# Altium schematic sheet IPG-V1_rev0.24.SchDoc (part 3 of 3)
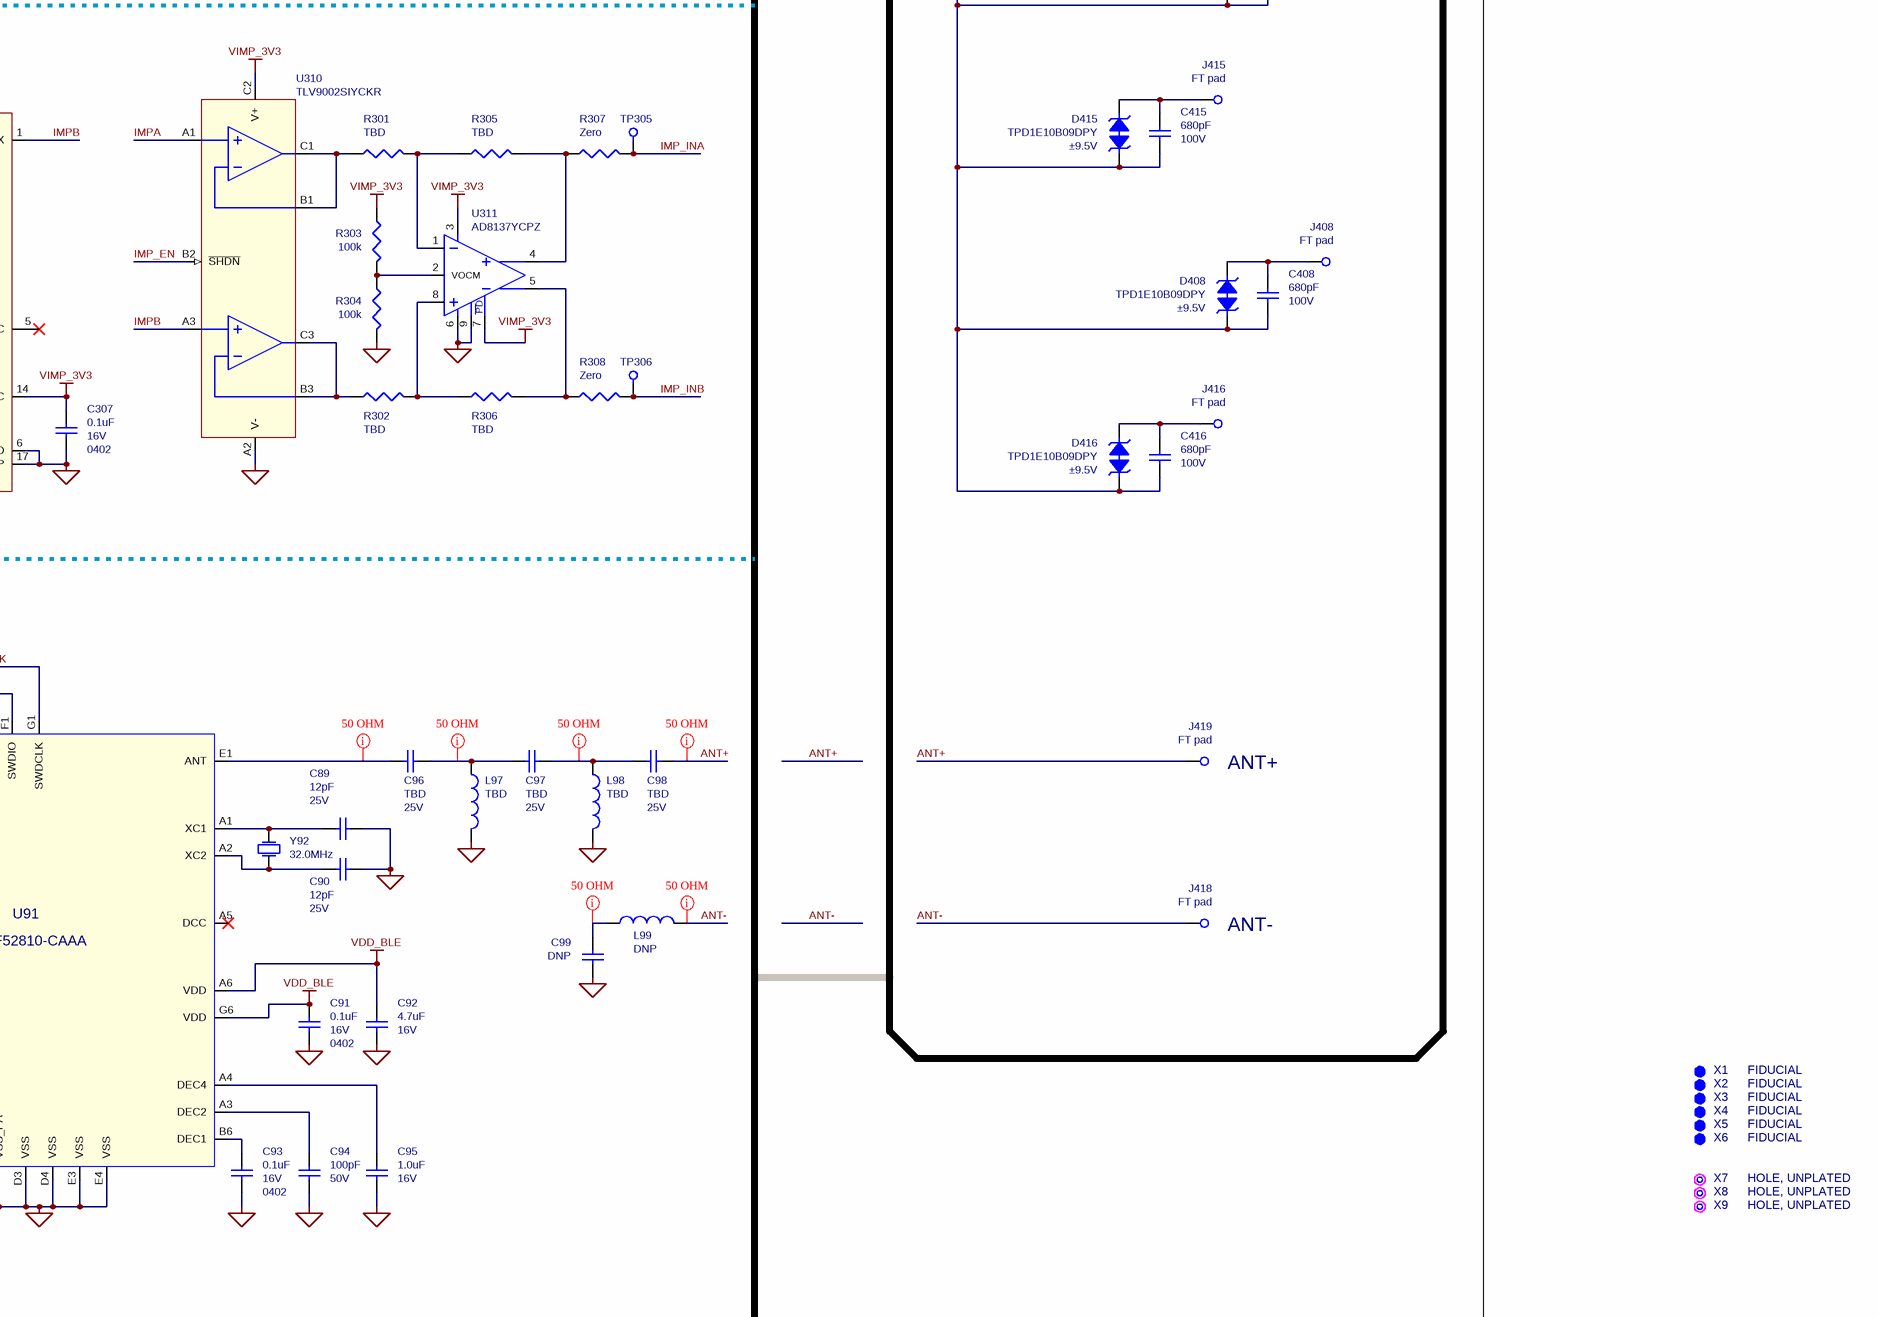
[diagram p10: IPG-V1_rev0.24.SchDoc, bottom right]

## Library data of the parts
C1 C2 = Cap: Resistor, Zero ohms, 40V, 40mW, 1%, 0402, Implant-grade; Manufacturer: Panasonic; Manufacturer PN: ERJ-2GE0R00X; Medical Grade MFR: Mini-Systems; Medical Grade MFR PN: WAJ20PG-NS62TRX; Rating: TBD; Length (mm): 1.10 ±0.10; PCB Footprint: cap0402_reduced; Thickness (mm): 0.56; Width (mm): 0.50 ±0.10; Category: Capacitor; Package Description: 0402
C3 C15 C16 C26 C37 C45 C46 C92 C511 C514 = Cap: Capacitor, 4.7uF, X5R, 16V, 10%, 0603, Implant-grade; Manufacturer: Murata; Manufacturer PN: GRM188R61C475KE11; Length (mm): 1.60 ±0.10; Medical Grade MFR: Murata; Medical Grade MFR PN: GCH188R61C475KE11; PCB Footprint: cap0603_reduced; Thickness (mm): 0.80 ±0.10; Width (mm): 0.80 ±0.10; Category: Capacitor; Package Description: 0603
C4 C5 C7 C9 C11-C14 C17 C27-C33 C35 C36 C38 C39 C91 C93 C206 C207 C243 C246 C247 C301 C303-C307 = Cap: Capacitor, 0.1uF, X7R, 16V, 10%, 0402, Implant-grade; Manufacturer: Murata; Manufacturer PN: GCM155R71C104KA55; Length (mm): 1.00 ±0.05; Medical Grade MFR: Murata; Medical Grade MFR PN: GCH155R71C104KE01; PCB Footprint: cap0402_reduced; Thickness (mm): 0.50 ±0.05; Width (mm): 0.50 ±0.05; Category: Capacitor
C6 C8 C507 = Cap: Capacitor, 470pF, X7R, 50V, 10%, 0402, Implant-grade; Manufacturer: Murata; Manufacturer PN: GCM155R71H471KA37D; Length (mm): 1.00 ±0.05; Medical Grade MFR: Murata; Medical Grade MFR PN: GCH155R71H471KE01; PCB Footprint: cap0402_reduced; Thickness (mm): 0.50 ±0.05; Width (mm): 0.50 ±0.05; Category: Capacitor; Package Description: 0402
C10 C18 C19 C34 C95 C244 = Cap: Capacitor, 1.0uF, X5R, 16V, 10%, 0603, Implant-grade; Manufacturer: Murata; Manufacturer PN: GCM188R71C105KA64; Length (mm): 1.60 ±0.10; Medical Grade MFR: Murata; Medical Grade MFR PN: GCH188R71C105KE01; PCB Footprint: cap0603_reduced; Thickness (mm): 0.80 ±0.10; Width (mm): 0.80 ±0.10; Category: Capacitor; Package Description: 0603
C20 C21 C505 C506 C510 = Cap: Capacitor, 4.7uF, X7S, 35V, 10%, 0805, Implant-grade; Manufacturer: Murata; Manufacturer PN: GCM21BC7YA475KE36L; Length (mm): 2.00 ±0.20; Medical Grade MFR: Murata; Medical Grade MFR PN: GCH21BC7YA475KE11; PCB Footprint: cap0805_reduced; Thickness (mm): 1.25 ±0.20; Width (mm): 1.25 ±0.20; Category: Capacitor; Package Description: 0805
C22-C25 C87-C90 = Cap: Capacitor, 12pF, C0G, 25V, ±0.05pF, 0402, Implant-grade; Manufacturer: AVX; Medical Grade MFR PN: MP023K1R5ABWG; Length (mm): 1.00 ±0.10; Manufacturer PN: C0402C120J3GACAUTO; Medical Grade MFR: AVX; PCB Footprint: cap0402_reduced; Thickness (mm): 0.40 ±0.10; Width (mm): 0.55 ±0.07; Category: Capacitor
  C87-C90: Package Description: 0402
C94 C508 = Cap: Capacitor, 100pF, C0G, 50V, 5%, 0402, Implant-grade; Manufacturer: Murata; Manufacturer PN: GCM1555C1H101JA16D; Length (mm): 1.00 ±0.05; Medical Grade MFR: Murata; Medical Grade MFR PN: GCH1555C1H101JE01; PCB Footprint: cap0402_reduced; Thickness (mm): 0.50 ±0.05; Width (mm): 0.50 ±0.05; Category: Capacitor; Package Description: 0402
C96-C98 C501-C504 = Cap: Manufacturer: TBD; Manufacturer PN: TBD; Medical Grade MFR: TBD; Medical Grade MFR PN: TBD; Category: Capacitor
  C96-C98: Length (mm): 1.00 ±0.10; PCB Footprint: cap0402_reduced; Thickness (mm): 0.40 ±0.10; Width (mm): 0.55 ±0.07; Package Description: 0402
  C501-C504: Length (mm): 2.00 ±0.20; PCB Footprint: cap0805_reduced; Rating: TBD; Thickness (mm): 1.37; Width (mm): 1.25 ±0.20; Package Description: 0805
C99 = Cap: Rating: 25V; Length (mm): 1.00 ±0.10; Manufacturer: N/A; Manufacturer PN: N/A; Medical Grade MFR: N/A; Medical Grade MFR PN: N/A; PCB Footprint: cap0402_reduced; Thickness (mm): 0.40 ±0.10; Width (mm): 0.55 ±0.07; Category: Capacitor; Package Description: 0402
C201 C241 C509 = Cap: Capacitor, 1000pF, X7R, 50V, 10%, 0402, Implant-grade; Manufacturer: Murata; Medical Grade MFR PN: GCH155R71H102KE01; Length (mm): 1.00 ±0.05; Manufacturer PN: GRM1555C1H102JA01D; Medical Grade MFR: Murata; PCB Footprint: cap0402_reduced; Thickness (mm): 0.50 ±0.05; Width (mm): 0.50 ±0.05; Category: Capacitor; Package Description: 0402
C202 C205 = Cap: Capacitor, 0.33uF, X7S, 16V, 10%, 0402; Manufacturer: TDK; Medical Grade MFR: TBD; Length (mm): 1.00 ±0.05; Manufacturer PN: CGA2B1X7S1C334K050BC; Medical Grade MFR PN: TBD; PCB Footprint: cap0402_reduced; Thickness (mm): 0.50 ±0.05; Width (mm): 0.50 ±0.05; Category: Capacitor; Package Description: 0402
C203 = Cap: Capacitor, 1500pF, X7R, 50V, 10%, 0402; Manufacturer: Murata; Medical Grade MFR: TBD; Length (mm): 1.00 ±0.05; Manufacturer PN: GCM155R71H152KA37D; Medical Grade MFR PN: TBD; PCB Footprint: cap0402_reduced; Thickness (mm): 0.50 ±0.05; Width (mm): 0.50 ±0.05; Category: Capacitor; Package Description: 0402
C204 = Cap: Capacitor, 0.01uF, X7R, 50V, 10%, 0402, Implant-grade; Manufacturer: Murata; Manufacturer PN: GCM155R71H103KA55J; Length (mm): 1.00 ±0.05; Medical Grade MFR: Murata; Medical Grade MFR PN: GCH155R71H103KE01; PCB Footprint: cap0402_reduced; Thickness (mm): 0.50 ±0.05; Width (mm): 0.50 ±0.05; Category: Capacitor; Package Description: 0402
C242 C245 = Cap: Capacitor, 2.2uF, X7R, 16V, 10%, 0603, Implant-grade; Manufacturer: Murata; Medical Grade MFR: TBD; Length (mm): 1.60 ±0.10; Manufacturer PN: GRM188Z71C225ME43J; Medical Grade MFR PN: TBD; PCB Footprint: cap0603_reduced; Thickness (mm): 0.80 ±0.10; Width (mm): 0.80 ±0.10; Category: Capacitor; Package Description: 0603
C381-C384 C397 = Cap: Capacitor, 10uF, X5R, 50V, 10%, 0805; Manufacturer: Murata; Length (mm): 2.00 ±0.20; Manufacturer PN: GRM21BR61H106ME43L; Medical Grade MFR: N/A; Medical Grade MFR PN: N/A; PCB Footprint: cap0805_reduced; Thickness (mm): 1.25 ±0.20; Width (mm): 1.25 ±0.20; Category: Capacitor; Package Description: 0805
C401-C416 = Cap: Capacitor, 680pF, C0G, 100V, 5%, 0402; Manufacturer: TDK; Medical Grade MFR: TBD; Length (mm): 1.00 ±0.10; Manufacturer PN: C1005C0G2A681J050BE; Medical Grade MFR PN: TBD; PCB Footprint: TBD; Thickness (mm): 0.50 ±0.10; Width (mm): 0.50 ±0.10; Category: Capacitor; Package Description: 0402
C512 C513 = Cap: Capacitor, 0.022uF, X7R, 50V, 10%, 0402, Implant-grade; Manufacturer: Murata; Manufacturer PN: GCM155R71H223KA55; Length (mm): 1.00 ±0.05; Medical Grade MFR: Murata; Medical Grade MFR PN: GCH155R71H223KE01; PCB Footprint: cap0402_reduced; Thickness (mm): 0.50 ±0.05; Width (mm): 0.50 ±0.05; Category: Capacitor; Package Description: 0402
D1-D5 D8-D10 D502 D503 D508 = NSR0130P2T5G: Schottky, 30V, 100mA, 385mV, 200mW, SOD-923; Manufacturer: ON Semiconductor; Medical Grade MFR: TBD; Length (mm): 1.00 ±0.05; Manufacturer PN: NSR0130P2T5G; Medical Grade MFR PN: TBD; PCB Footprint: TBD; Rating: 30V; Thickness (mm): 0.40 ±0.03; Value: NSR0130P2T5G; Width (mm): 0.60 ±0.05; Category: Diode
D6 D7 D11-D14 D501 D504-D507 = NSR05T40XV2T5G: Schottky, 40V, 500mA, 530mV, SOD-523; Manufacturer: ON Semiconductor; Medical Grade MFR: TBD; Length (mm): 1.60 ±0.10; Manufacturer PN: NSR05T40XV2T5G; Medical Grade MFR PN: TBD; PCB Footprint: TBD; Rating: 40V, 500mA; Thickness (mm): 0.60 ±0.10; Value: NSR05T40XV2T5G; Width (mm): 0.80 ±0.10; Category: Diode
D401-D418 = TPD1E10B09: TVS Diode, Bidirectional, ±9.5V, 4.5A, 0402; Manufacturer: Texas Instruments; Medical Grade MFR: TBD; Category: TVS Diode; Length (mm): 1.00 ±0.10; Manufacturer PN: TPD1E10B09DPY; Medical Grade MFR PN: TBD; PCB Footprint: TBD; Thickness (mm): 0.38 ±0.07; Width (mm): 0.60 ±0.10; Package Description: TBD
F1 F2 = Fuse 2: Fuse, 750mA, 63V, 1206; Manufacturer: Littelfuse; Medical Grade MFR PN: 0440.750WRA; PCB Footprint: fuse1206_reduced; Length (mm): 3.20 ±0.18; Manufacturer PN: 0440.750WR; Medical Grade MFR: Littelfuse; Rating: 750mA; Thickness (mm): 0.84 ±0.01; Width (mm): 1.63 ±0.10; Category: Fuse
J1-J4 = Kovar Block: Kovar block, TBD; Manufacturer: TBD; Manufacturer PN: TBD; Medical Grade MFR: N/A; Medical Grade MFR PN: N/A; PCB Footprint: TBD; Rating: N/A; Value: Kovar block; Category: Kovar block; Length (mm): TBD; Thickness (mm): TBD; Width (mm): TBD
J5 J6 J501 J502 = FT Pad: Coil TH pad, hole size and ring TBD; Value: Coil Solder Pad; Category: Coil Solder Pad; Length (mm): TBD; Manufacturer: N/A; Manufacturer PN: N/A; Medical Grade MFR: N/A; Medical Grade MFR PN: N/A; PCB Footprint: TBD; Rating: N/A; Thickness (mm): N/A; Width (mm): TBD; Package Description: N/A
J401-J419 = HOLE_20m: FT pad, Thru-hole, 20 mil hole; PCB Footprint: TBD; Category: FT pad; Length (mm): TBD; Manufacturer: N/A; Manufacturer PN: N/A; Medical Grade MFR: N/A; Medical Grade MFR PN: N/A; Rating: N/A; Thickness (mm): N/A; Width (mm): TBD; Package Description: FT pad
J901 J902 J905 = TMS-104-01-G-S: Header, 1.27mm, male, 1x4, thru-hole; Manufacturer: Samtec; Category: Header; Manufacturer PN: TMS-104-01-G-S
J906-J909 = TMS-106-01-G-S: Header, 1.27mm, male, 1x6, thru-hole; Manufacturer: Samtec; Alt Manufacturer: -; Alt Manufacturer PN: -; Category: Header; Manufacturer PN: TMS-106-01-G-S; Supplier 1: Digi-Key; Supplier Part Number 1: SAM10248-ND
J910 J911 = FTSH-105-01-F-D-K: Connector, 1.27 mm, 2x5, Male, TH; Manufacturer: Samtec; Manufacturer PN: FTSH-105-01-F-D-K; Supplier 1: Mouser; Supplier Part Number 1: 200-FTSH10501FDK
L1 L2 = Inductor: PCB Footprint: sml_0402_reduced; Rating: 500mA; Length (mm): 1.00; Manufacturer: N/A; Manufacturer PN: N/A; Medical Grade MFR: N/A; Medical Grade MFR PN: N/A; Thickness (mm): TBD; Width (mm): 0.50; Category: Inductor
L3 L501 = Inductor: Inductor, 10uH, 600mA, 20%, 1008; Manufacturer: Wurth; Medical Grade MFR: TBD; Length (mm): 2.50 ±0.20; Manufacturer PN: 74438323100; Medical Grade MFR PN: TBD; PCB Footprint: TBD; Rating: 600mA; Thickness (mm): 1.00; Width (mm): 2.00 ±0.20; Category: Inductor
L5 = VLS252010HBX-2R2M-1: Inductor, 2.2uH, 1.76A, 1008; Manufacturer: TDK; Category: Inductor; Rating: 1.76A; Manufacturer PN: VLS252010HBX-2R2M-1
L6 = LQG15HS33NJ02D: Inductor, Unshielded, 33nH, 350mA, 0402; Manufacturer: Murata; Medical Grade MFR: TBD; Category: Inductor; Length (mm): TBD; Manufacturer PN: LQG15HS33NJ02D; Medical Grade MFR PN: TBD; Thickness (mm): TBD; Width (mm): TBD; PCB Footprint: TBD
L97 L98 = Inductor: PCB Footprint: ind0402_reduced; Rating: 1200mA; Category: Inductor; Length (mm): 1.11; Manufacturer: TBD; Manufacturer PN: TBD; Medical Grade MFR: TBD; Medical Grade MFR PN: TBD; Thickness (mm): 0.65; Width (mm): 0.66; Package Description: 0402
L99 = Inductor: PCB Footprint: ind0402_reduced; Category: Inductor; Length (mm): 1.11; Manufacturer: N/A; Manufacturer PN: N/A; Medical Grade MFR: N/A; Medical Grade MFR PN: N/A; Rating: N/A; Thickness (mm): 0.65; Width (mm): 0.66; Package Description: 0402
M1 M2 M5 M13 M21 M22 M24 M27 M28 M30 = DMP21D5UFB4-7B: MOSFET, P-chan, -20V, X2-DFN1006-3; Manufacturer: Diodes Inc; Medical Grade MFR: TBD; Category: Transistor; Length (mm): 1.00 ±0.05; Medical Grade MFR PN: TBD; Rating: -20V; Thickness (mm): 0.40; Width (mm): 0.60 ±0.05; Manufacturer PN: DMP21D5UFB4-7B
M3 M4 M6-M8 M11 M12 M14-M16 M19 M20 M23 M25 M26 M29 M31 M319 = DMN2990UFZ: MOSFET, N-Chan, 20V, DFN0606; Manufacturer: Diodes Inc; Medical Grade MFR: TBD; Category: Transistor; Length (mm): 0.62 ±0.05; Manufacturer PN: DMN2990UFZ; Medical Grade MFR PN: TBD; PCB Footprint: TBD; Rating: 20V; Thickness (mm): 0.38 ±0.02; Value: DMN2990UFZ; Width (mm): 0.62 ±0.05
M9 M10 M17 M18 M506 = DMP22D4UFO: MOSFET, P-chan, -20V, DFN1010-3; Manufacturer: Diodes Inc; Medical Grade MFR: TBD; Category: Transistor; Length (mm): 0.96 ±0.04; Manufacturer PN: DMP2043UCA3-7; Medical Grade MFR PN: TBD; PCB Footprint: TBD; Rating: -20V; Thickness (mm): 0.32 ±0.03; Width (mm): 0.96 ±0.04
M32 M504 M507 M508 M510 = DMP58D0LFB: MOSFET, P-chan, -50V, DFN1006; Manufacturer: Diodes Inc; Medical Grade MFR: TBD; Category: Transistor; Length (mm): 1.00 ±0.08; Manufacturer PN: DMP58D0LFB; Medical Grade MFR PN: TBD; PCB Footprint: TBD; Rating: -50V; Thickness (mm): 0.50 ±0.03; Width (mm): 0.60 ±0.08; Value: DMP58D0LFB
M33 M91 M318 = DMP22D4UFO: MOSFET, P-chan, -20V, DFN0604; Manufacturer: Diodes Inc; Medical Grade MFR: TBD; Category: Transistor; Length (mm): 0.60 ±0.05; Manufacturer PN: DMP22D4UFO; Medical Grade MFR PN: TBD; PCB Footprint: TBD; Rating: -20V; Thickness (mm): 0.36 ±0.04; Value: DMP22D4UFO; Width (mm): 0.40 ±0.05
  M91: PackageDescription: TBD
  M318: Package Description: TBD
M34 M501-M503 M505 = DMN62D1SFB: MOSFET, N-Chan, 60V, 320mA, DFN1006; Manufacturer: Diodes Inc; Medical Grade MFR: TBD; Category: Transistor; Length (mm): 1.00 ±0.08; Manufacturer PN: DMN62D1LFB-7B; Medical Grade MFR PN: TBD; PCB Footprint: TBD; Rating: 60V; Thickness (mm): 0.50 ±0.03; Width (mm): 0.60 ±0.08
M301-M304 M317 = DMN65D8LFB-7B: MOSFET, N-Chan, 60V, DFN1006; Manufacturer: Diodes Inc; Medical Grade MFR: TBD; Category: Transistor; Length (mm): 1.00 ±0.08; Manufacturer PN: DMN65D8LFB-7B; Medical Grade MFR PN: TBD; PCB Footprint: TBD; Thickness (mm): 0.50 ±0.03; Width (mm): 0.60 ±0.08
M509 M511-M514 = DMN62D1SFB: MOSFET, N-Chan, 60V, DFN1006; Manufacturer: Diodes Inc; Medical Grade MFR: TBD; Category: Transistor; Length (mm): 1.00 ±0.08; Manufacturer PN: DMN62D1SFB; Medical Grade MFR PN: TBD; PCB Footprint: TBD; Rating: 60V; Thickness (mm): 0.50 ±0.03; Width (mm): 0.60 ±0.08; Value: DMN62D1SFB
M515 = DMN62D1SFB: MOSFET, N-Chan, 20V, DFN1006; Manufacturer: Diodes Inc; Medical Grade MFR: TBD; Category: Transistor; Length (mm): 1.00 ±0.08; Manufacturer PN: DMN2501UFB4; Medical Grade MFR PN: TBD; PCB Footprint: TBD; Rating: 20V; Thickness (mm): 0.50 ±0.03; Width (mm): 0.60 ±0.08; Value: DMN2501UFB4
Q301-Q304 Q317 = DP0150BDJ: Transistor, Dual PNP, -40V, 200mA, SOT963; Manufacturer: ON Semi; Medical Grade MFR: TBD; Category: Transistor; Length (mm): 1.00 ±0.05; Manufacturer PN: NST3906DP6T5G; Medical Grade MFR PN: TBD; PCB Footprint: TBD; Thickness (mm): 0.45 ±0.05; Value: NST3906DP6T5G; Width (mm): 1.00 ±0.05; Package Description: SOT963
Q318 Q321-Q324 Q337 = BC847BLP-7B: Transistor, NPN, 45V, 100mA, DFN1006; Manufacturer: Diodes Inc; Medical Grade MFR: TBD; Category: Transistor; Length (mm): 1.00 ±0.08; Manufacturer PN: BC847BLP-7B; Medical Grade MFR PN: TBD; PCB Footprint: TBD; Thickness (mm): 0.50 ±0.03; Width (mm): 0.60 ±0.08
R1 R2 R4 R6 R7 R13 R15 R21 R36 R37 R40-R43 R201 R202 R207 R208 R213 R214 R241 R242 R247 R248 R253 R254 R309 R351-R354 R367 = RC1005F106CS: Resistor, 10.0M, 40V, 40mW, 1%, 0402, Implant-grade; Manufacturer: Panasonic; Manufacturer PN: ERJ-2GEJ106X; Medical Grade MFR: Mini-Systems; Length (mm): 1.12 ±0.10; Medical Grade MFR PN: WA20SM-1005F-NS62TRX; PCB Footprint: res0402_reduced; Rating: 40V; Thickness (mm): 0.33 ±0.08; Width (mm): 0.56 ±0.08; Category: Resistor
  R202 R242 R247 R248 R253 R254: Package Description: 0402
R3 R33 = RC1005F106CS: Resistor, 5.10M, 40V, 40mW, 5%, 0402, Implant-grade; Manufacturer: Panasonic; Manufacturer PN: ERJ-2GEJ515X; Medical Grade MFR: Mini-Systems; Length (mm): 1.12 ±0.10; Medical Grade MFR PN: WA20SM-5104F-NS62TRX; PCB Footprint: res0402_reduced; Rating: 40V; Thickness (mm): 0.33 ±0.08; Width (mm): 0.56 ±0.08; Category: Resistor
R5 R34 R51-R55 R298 = RC1005F106CS: Resistor, 10.0k, 40V, 40mW, 1%, 0402, Implant-grade; Manufacturer: Panasonic; Manufacturer PN: ERJ-2RKF1002X; Medical Grade MFR: Mini-Systems; Length (mm): 1.12 ±0.10; Medical Grade MFR PN: WA20SM-1002F-NS62TRX; PCB Footprint: res0402_reduced; Rating: 40V; Thickness (mm): 0.33 ±0.08; Width (mm): 0.56 ±0.08; Category: Resistor
R8 R16 = RC1005F106CS: Resistor, 4.02k, 40V, 40mW, 1%, 0402, Implant-grade; Manufacturer: Panasonic; Manufacturer PN: ERJ-2RKF4021X; Medical Grade MFR: Mini-Systems; Length (mm): 1.12 ±0.10; Medical Grade MFR PN: WA20SM-4021F-NS62TRX; PCB Footprint: res0402_reduced; Rating: 40V; Thickness (mm): 0.33 ±0.08; Width (mm): 0.56 ±0.08; Category: Resistor
R9 R17 = RC1005F106CS: Resistor, 7.50k, 40V, 40mW, 1%, 0402, Implant-grade; Manufacturer: Panasonic; Manufacturer PN: ERJ-2RKF7501X; Medical Grade MFR: Mini-Systems; Length (mm): 1.12 ±0.10; Medical Grade MFR PN: WA20SM-7501F-NS62TRX; PCB Footprint: res0402_reduced; Rating: 40V; Thickness (mm): 0.33 ±0.08; Width (mm): 0.56 ±0.08; Category: Resistor
R10 R18 = RC1005F106CS: Resistor, 619k, 40V, 100mW, 0.1%, 0402; Manufacturer: Vishay; Medical Grade MFR: TBD; Length (mm): 1.12 ±0.10; Manufacturer PN: MCS0402MD6193BE000; Medical Grade MFR PN: TBD; PCB Footprint: res0402_reduced; Thickness (mm): 0.33 ±0.08; Width (mm): 0.56 ±0.08; Category: Resistor
R11 R19 = RC1005F106CS: Resistor, 243k, 40V, 100mW, 0.1%, 0402; Manufacturer: TE Connectivity; Medical Grade MFR: TBD; Length (mm): 1.12 ±0.10; Manufacturer PN: RP73PF1E243KBTDF; Medical Grade MFR PN: TBD; PCB Footprint: res0402_reduced; Thickness (mm): 0.33 ±0.08; Width (mm): 0.56 ±0.08; Category: Resistor
R12 R14 R20 R22-R24 R26 R27 R29 R32 R209 R210 R212 R249 R250 R252 R276 R279 R502-R504 R506 R507 R509 R510 R512-R515 R517-R519 R521 R525 R526 = RC1005F106CS: Resistor, 1.00M, 40V, 40mW, 1%, 0402, Implant-grade; Manufacturer: Panasonic; Manufacturer PN: ERJ-2RKF1004X; Medical Grade MFR: Mini-Systems; Length (mm): 1.12 ±0.10; Medical Grade MFR PN: WA20SM-1004F-NS62TRX; PCB Footprint: res0402_reduced; Rating: 40V; Thickness (mm): 0.33 ±0.08; Width (mm): 0.56 ±0.08; Category: Resistor
  R210 R212 R250: Package Description: 0402
R25 R28 R371-R374 R387 R523 = RC1005F106CS: Resistor, 2.00M, 40V, 40mW, 1%, 0402, Implant-grade; Manufacturer: Panasonic; Manufacturer PN: ERJ-2GEJ205X; Medical Grade MFR: Mini-Systems; Length (mm): 1.12 ±0.10; Medical Grade MFR PN: WA20SM-2004F-NS62TRX; PCB Footprint: res0402_reduced; Rating: 40V; Thickness (mm): 0.33 ±0.08; Width (mm): 0.56 ±0.08; Category: Resistor
R30 R47 R48 R215 R255 R300 R307 R308 R531 = R_ZERO_0402: Resistor, Zero ohms, 40V, 40mW, 1%, 0402, Implant-grade; Manufacturer: Panasonic; Manufacturer PN: ERJ-2GE0R00X; Medical Grade MFR: Mini-Systems; Length (mm): 1.12 ±0.10; Medical Grade MFR PN: WAJ20PG-NS62TRX; PCB Footprint: res0402_reduced; Rating: 40V; Thickness (mm): 0.33 ±0.08; Width (mm): 0.56 ±0.08; Category: Resistor
  R215 R255 R300: Package Description: 0402
  R307 R308: Package Description: TBD
R31 R49 R50 R281-R284 R297 R299 R524 R527 R529 R530 = RC1005F106CS: Length (mm): 1.12 ±0.10; Manufacturer: N/A; Manufacturer PN: N/A; Medical Grade MFR: N/A; Medical Grade MFR PN: N/A; PCB Footprint: res0402_reduced; Rating: N/A; Thickness (mm): 0.33 ±0.08; Width (mm): 0.56 ±0.08; Category: Resistor
R35 = RC1005F106CS: Resistor, 100, 40V, 40mW, 1%, 0402, Implant-grade; Manufacturer: Panasonic; Manufacturer PN: ERJ-2RKF1000X; Medical Grade MFR: Mini-Systems; Length (mm): 1.12 ±0.10; Medical Grade MFR PN: WA20SM-1000F-NS62TRX; PCB Footprint: res0402_reduced; Rating: 40V; Thickness (mm): 0.33 ±0.08; Width (mm): 0.56 ±0.08; Category: Resistor
R38 = RC1005F106CS: Resistor, 340k, 40V, 40mW, 1%, 0402, Implant-grade; Manufacturer: Panasonic; Manufacturer PN: ERJ-2RKF3403X; Medical Grade MFR: Mini-Systems; Length (mm): 1.12 ±0.10; Medical Grade MFR PN: WA20SM-3403F-NS62TRX; PCB Footprint: res0402_reduced; Rating: 40V; Thickness (mm): 0.33 ±0.08; Width (mm): 0.56 ±0.08; Category: Resistor
R39 R520 = RC1005F106CS: Resistor, 40.2k, 40V, 40mW, 1%, 0402, Implant-grade; Manufacturer: Panasonic; Manufacturer PN: ERJ-2RKF4022X; Medical Grade MFR: Mini-Systems; Length (mm): 1.12 ±0.10; Medical Grade MFR PN: WA20SM-4022F-NS62TRX; PCB Footprint: res0402_reduced; Rating: 40V; Thickness (mm): 0.33 ±0.08; Width (mm): 0.56 ±0.08; Category: Resistor
R44 R516 = RC1005F106CS: Resistor, 150k, 40V, 40mW, 1%, 0402, Implant-grade; Manufacturer: Panasonic; Manufacturer PN: ERJ-2RKF1503X; Medical Grade MFR: Mini-Systems; Length (mm): 1.12 ±0.10; Medical Grade MFR PN: WA20SM-1503F-NS62TRX; PCB Footprint: res0402_reduced; Rating: 40V; Thickness (mm): 0.33 ±0.08; Width (mm): 0.56 ±0.08; Category: Resistor
R45 R46 = RC1005F106CS: Resistor, 49.9k, 40V, 40mW, 1%, 0402, Implant-grade; Manufacturer: Panasonic; Manufacturer PN: ERJ-2RKF4992X; Medical Grade MFR: Mini-Systems; Length (mm): 1.12 ±0.10; Medical Grade MFR PN: WA20SM-4992F-NS62TRX; PCB Footprint: res0402_reduced; Rating: 40V; Thickness (mm): 0.33 ±0.08; Width (mm): 0.56 ±0.08; Category: Resistor
R203 R204 R243 R244 = RC1005F106CS: Resistor, 180k, 40V, 40mW, 1%, 0402; Manufacturer: KOA Speer; Medical Grade MFR: Mini-Systems; Medical Grade MFR PN: WA20SM-1803F-NS62TRX; Length (mm): 1.12 ±0.10; Manufacturer PN: RK73H1ETTP1803F; PCB Footprint: res0402_reduced; Rating: 40V; Thickness (mm): 0.33 ±0.08; Width (mm): 0.56 ±0.08; Category: Resistor; Package Description: 0402
R205 R245 = RC1005F106CS: Resistor, 360k, 40V, 40mW, 1%, 0402, Implant-grade; Manufacturer: Panasonic; Manufacturer PN: ERJ-2RKF3603X; Medical Grade MFR: Mini-Systems; Length (mm): 1.12 ±0.10; Medical Grade MFR PN: WA20SM-3603F-NS62TRX; PCB Footprint: res0402_reduced; Rating: 40V; Thickness (mm): 0.33 ±0.08; Width (mm): 0.56 ±0.08; Category: Resistor; Package Description: 0402
R206 R246 = RC1005F106CS: Resistor, 1.40M, 40V, 40mW, 1%, 0402, Implant-grade; Manufacturer: Yageo; Manufacturer PN: RC0402FR-071M4L; Medical Grade MFR: Mini-Systems; Length (mm): 1.12 ±0.10; Medical Grade MFR PN: WA20SM-1404F-NS62TRX; PCB Footprint: res0402_reduced; Rating: 40V; Thickness (mm): 0.33 ±0.08; Width (mm): 0.56 ±0.08; Category: Resistor
R211 = RC1005F106CS: Resistor, 249k, 40V, 40mW, 1%, 0402, Implant-grade; Manufacturer: Panasonic; Manufacturer PN: ERJ-2RKF2493X; Medical Grade MFR: Mini-Systems; Length (mm): 1.12 ±0.10; Medical Grade MFR PN: WA20SM-2493F-NS62TRX; PCB Footprint: res0402_reduced; Rating: 40V; Thickness (mm): 0.33 ±0.08; Width (mm): 0.56 ±0.08; Category: Resistor; Package Description: 0402
R251 R303 R304 R508 R522 = RC1005F106CS: Resistor, 100k, 40V, 40mW, 1%, 0402, Implant-grade; Manufacturer: Panasonic; Manufacturer PN: ERJ-2RKF1003X; Medical Grade MFR: Mini-Systems; Length (mm): 1.12 ±0.10; Medical Grade MFR PN: WA20SM-1003F-NS62TRX; PCB Footprint: res0402_reduced; Rating: 40V; Thickness (mm): 0.33 ±0.08; Width (mm): 0.56 ±0.08; Category: Resistor
  R303 R304: Package Description: TBD
R277 = ERJ-2GEJ106X: Resistor, 100 ohms, 1%, 50V, 0.1W, 0402; Manufacturer: Panasonic; Rating: 50V,100mW; Length (mm): 1.12 ±0.10; Manufacturer PN: ERJ-2RKF1000X; Medical Grade MFR: N/A; Medical Grade MFR PN: N/A; PCB Footprint: res0402_reduced; Thickness (mm): 0.33 ±0.08; Width (mm): 0.56 ±0.08; Category: Resistor; Package Description: 0402
R278 R311-R314 R327 = ERJ-2GEJ106X: Resistor, 1.00k, 1%, 50V, 0.1W, 0402; Manufacturer: Panasonic; Rating: 50V,100mW; Length (mm): 1.12 ±0.10; Manufacturer PN: ERJ-2RKF1001X; Medical Grade MFR: N/A; Medical Grade MFR PN: N/A; PCB Footprint: res0402_reduced; Thickness (mm): 0.33 ±0.08; Width (mm): 0.56 ±0.08; Category: Resistor; Package Description: 0402
R301 R302 R305 R306 = RC1005F106CS: Resistor, TBD, 0402; Rating: 40V; Length (mm): 1.12 ±0.10; Manufacturer: TBD; Manufacturer PN: TBD; Medical Grade MFR: TBD; Medical Grade MFR PN: TBD; PCB Footprint: res0402_reduced; Thickness (mm): 0.33 ±0.08; Width (mm): 0.56 ±0.08; Category: Resistor; Package Description: TBD
R331-R334 R347 = ERJ-2GEJ106X: Resistor, 40.2 ohms, 50V, 100mW, 1%, 0402; Manufacturer: Panasonic; Length (mm): 1.12 ±0.10; Manufacturer PN: ERJ-2RKF40R2X; Medical Grade MFR: N/A; Medical Grade MFR PN: N/A; PCB Footprint: res0402_reduced; Rating: 50V,100mW; Thickness (mm): 0.33 ±0.08; Width (mm): 0.56 ±0.08; Category: Resistor; Package Description: 0402
R501 R511 R528 = RC1005F106CS: Resistor, 402 ohms, 40V, 40mW, 1%, 0805, Implant-grade; Manufacturer: Panasonic; Manufacturer PN: ERJ-2RKF4020X; Medical Grade MFR: Mini-Systems; PCB Footprint: res0805_reduced; Length (mm): 2.03 ±0.15; Medical Grade MFR PN: WA20SM-4020F-NS62TRX; Rating: 40V; Thickness (mm): 0.46 ±0.08; Width (mm): 1.27 ±0.08; Category: Resistor
R505 = RC1005F106CS: Resistor, 49.9 ohms, 125V, 200mW, 1%, 0805, Implant-grade; Manufacturer: Panasonic; Manufacturer PN: ERJ-6ENF49R9V; Medical Grade MFR: Mini-Systems; PCB Footprint: res0805_reduced; Rating: 40V; Length (mm): 2.03 ±0.15; Medical Grade MFR PN: WA86SM-49R9F-NS62TRX; Thickness (mm): 0.46 ±0.08; Width (mm): 1.27 ±0.08; Category: Resistor
SW901 = PTS 647 SN50 SMTR2 LFS: Pushbutton, NO-MOM, 12V, 0.05A, SMT; Manufacturer: C&K; Category: Pushbutton; Length (mm): 6.5 ±0.20; Manufacturer PN: PTS647SN50SMTR2LFS; Rating: 12V,0.05A; Thickness (mm): 1.55 ±0.15; Width (mm): 4.5; Supplier 1: Digi-Key; Supplier Part Number 1: PTS647SN50SMTR2LFSCT-ND; Package Description: SMT
TP1-TP49 TP81-TP86 TP90-TP99 TP301 TP303-TP307 TP501-TP512 = Test Point: Test pad, 0.90mm circular pad; PCB Footprint: testpad_0p90mm; Length (mm): 0.90; Manufacturer: N/A; Manufacturer PN: N/A; Medical Grade MFR: N/A; Medical Grade MFR PN: N/A; Rating: N/A; Thickness (mm): N/A; Value: Test point; Width (mm): 0.90; Category: Test point
  TP81: PackageDescription: N/A
  TP305-TP307: Package Description: N/A
U1 U10 U11 = AP7354D: LDO Regulator, 3.3V, Shutdown, DFN1010-4; Manufacturer: Diodes Inc; Medical Grade MFR: TBD; Length (mm): 1.00 ±0.05; Manufacturer PN: AP7354D-33FS4-7; Medical Grade MFR PN: TBD; PCB Footprint: TBD; Rating: 3.3V; Thickness (mm): 0.39 ±0.01; Value: AP7354D-33FS4-7; Width (mm): 1.00 ±0.05; Category: IC; Package Description: TBD
U2 U4 = LTC4065: Charge Controller, 4.2V, 250mA, DFN-6; Manufacturer: Linear Technology; Medical Grade MFR: TBD; Category: IC; Length (mm): 2.00 ±0.10; Manufacturer PN: LTC4065LEDC#TRMPBF; Medical Grade MFR PN: TBD; PCB Footprint: TBD; Rating: 250mA; Thickness (mm): 0.75 ±0.05; Value: LTC4065LEDC#TRMPBF; Width (mm): 2.00 ±0.10; Alt Manufacturer: -; Alt Manufacturer PN: -
U3 U5 = TLV4021R1YKAR: Comparator, 1.2V Reference, Open-drain, BGA-4; Manufacturer: Texas Instruments; Medical Grade MFR: TBD; Category: IC; Length (mm): 0.73 ±0.03; Manufacturer PN: TLV4021R1YKAR; Medical Grade MFR PN: TBD; Package Description: TBD; PCB Footprint: TBD; Rating: TBD; Thickness (mm): 0.40; Value: TLV4021R1YKAR
U6 U7 U14-U16 U501 = AD8505ACBZ: Op Amp, Rail-to-Rail, 95kHz, WLCSP-6; Manufacturer: Analog Devices; Medical Grade MFR: TBD; Rating: 5.5V; Category: IC; Length (mm): 1.39 ±0.04; Manufacturer PN: AD8505ACBZ; Medical Grade MFR PN: TBD; PCB Footprint: TBD; Thickness (mm): 0.56 ±0.05; Value: AD8505ACBZ; Width (mm): 0.90 ±0.04
  U6 U7: Package Description: TBD
U8 = BD027-14E: Magnet Sensor, 15 Gauss, ULLGA4, Implant-grade; Manufacturer: NVE; Manufacturer PN: ADL021-14E; PCB Footprint: TBD; Value: ADL021-14E; Length (mm): 1.10; Medical Grade MFR: NVE; Medical Grade MFR PN: BD020-14E; Rating: N/A; Thickness (mm): 0.40; Width (mm): 1.10; Category: IC; Package Description: TBD
U9 = CY15B108QN: FRAM, 8 Mbit (1024k x 8), SPI, 1.8-3.6V, QFN-8; Manufacturer: Cypress Semiconductor; Medical Grade MFR: TBD; Rating: 3.6V; Category: IC; Length (mm): 3.28 ±0.05; Manufacturer PN: CY15B108QN-20LPXC; Medical Grade MFR PN: TBD; PCB Footprint: TBD; Thickness (mm): 0.50 ±0.05; Value: CY15B108QN-20LPXC; Width (mm): 3.23 ±0.05; Package Description: TBD
U12 = LT1615: Boost converter, SEPIC, 100 mA, SOT23-5; Manufacturer: Linear Technology; Medical Grade MFR: TBD; Rating: 100 mA; Category: IC; Length (mm): 2.80 ±0.20; Manufacturer PN: LT1615ES5-1#TRPBF; Medical Grade MFR PN: TBD; Package Description: TBD; PCB Footprint: TBD; Thickness (mm): 1.00; Value: LT1615ES5-1#TRPBF; Width (mm): 2.95 ±0.15
U13 = ISL23315: Digital potentiometer, 256 taps, 100k, I2C, QFN-10; Manufacturer: Renesas; Medical Grade MFR: TBD; Category: IC; Length (mm): 2.10; Manufacturer PN: ISL23315TFRUZ-T; Medical Grade MFR PN: TBD; Package Description: TBD; PCB Footprint: TBD; Rating: TBD; Thickness (mm): 0.55; Value: ISL23315TFRUZ-T; Width (mm): 1.60
U17 = STM32U585QII3: Microcontroller, ARM Cortex-M33, 2.0 MB Flash, 786 kB RAM, BGA-132; Manufacturer: STMicro; Medical Grade MFR: TBD; Category: IC; Length (mm): 7.00 ±0.15; Manufacturer PN: STM32U585QII3; Medical Grade MFR PN: TBD; Package Description: TBD; PCB Footprint: TBD; Rating: TBD; Thickness (mm): 0.60; Value: STM32U585QII3; Width (mm): 7.00 ±0.15
U18 = TPS3831_b: Reset Monitor, 2.63V, Active low, X2SON; Manufacturer: Texas Instruments; Medical Grade MFR: TBD; Category: IC; Length (mm): 1.00 ±0.05; Manufacturer PN: TPS3831L30; Medical Grade MFR PN: TBD; PCB Footprint: TBD; Rating: N/A; Thickness (mm): 0.40; Value: TPS3831L30; Width (mm): 1.00 ±0.05; Package Description: TBD
U30 U31 = ADG5234: Analog switch, Quad SPDT, 4.5 ohm, QFN20; Manufacturer: Analog Devices; PCB Footprint: TBD; Category: IC; Length (mm): 4.00 ±0.10; Manufacturer PN: ADG1634BCPZ-REEL7; Medical Grade MFR: N/A; Medical Grade MFR PN: N/A; Rating: TBD; Thickness (mm): 0.75 ±0.05; Value: ADG1634BCPZ; Width (mm): 4.00 ±0.10; Package Description: TBD
U91 = NRF52810: Bluetooth radio, v5.0, 192 kB Flash, 24 kB RAM, BGA-33; Manufacturer: Nordic; Medical Grade MFR: TBD; Category: IC; Length (mm): 2.48; Manufacturer PN: NRF52810-CAAA; Medical Grade MFR PN: TBD; Package Description: TBD; PCB Footprint: TBD; Rating: TBD; Thickness (mm): 0.48 ±0.06; Value: NRF52810-CAAA; Width (mm): 2.46
U201 U203 = AD8233: Analog front end, ECG, RLD amp, BGA-20; Manufacturer: Analog Devices; Medical Grade MFR: TBD; Category: IC; Length (mm): 2.04 ±0.04; Manufacturer PN: AD8233ACBZ; Medical Grade MFR PN: TBD; Package Description: TBD; PCB Footprint: TBD; Rating: TBD; Thickness (mm): 0.50 ±0.06; Value: AD8233ACBZ; Width (mm): 1.71 ±0.04
U301 = DAC80502DRXT: DAC, 16-bit, Dual channel, SPI/I2C, WSON-10; Manufacturer: Texas Instruments; Rating: 2.7-5.5V; Category: IC; Length (mm): 2.50 ±0.10; Manufacturer PN: DAC80502DRXT; Medical Grade MFR: N/A; Medical Grade MFR PN: N/A; Package Description: N/A; PCB Footprint: N/A; Thickness (mm): 0.75 ±0.05; Value: DAC80502DRXT; Width (mm): 2.50 ±0.10
U303 U304 = TS5A3159A_0: Analog Switch, SPDT, 2:1, DSBGA6; Manufacturer: Texas Instruments; Medical Grade MFR: TBD; Rating: 5.0V; Category: IC; Length (mm): 1.39 ±0.03; Thickness (mm): 0.50 ±0.10; Width (mm): 0.89 ±0.03; Manufacturer PN: TS5A3159AYZPR; Medical Grade MFR PN: TBD; Package Description: TBD; PCB Footprint: TBD; Value: TS5A3159AYZPR
U305 = TLV9002SIYCKR_d: Op Amp, Dual, Rail-to-Rail, 1MHz, BGA-9; Manufacturer: Texas Instruments; Medical Grade MFR: TBD; Rating: 5.5V; Category: IC; Length (mm): 0.95 ±0.03; Manufacturer PN: TLV9002SIYCKR; Medical Grade MFR PN: TBD; Package Description: TBD; PCB Footprint: TBD; Thickness (mm): 0.33; Value: TLV9002SIYCKR; Width (mm): 0.95 ±0.03
U306 = SN74LVC1G123DCUR: Monostable, RC set, dual triggers, BGA-8; Manufacturer: Texas Instruments; Medical Grade MFR: TBD; Category: IC; Length (mm): 1.89 ±0.03; Manufacturer PN: SN74LVC1G123YZPR; Medical Grade MFR PN: TBD; Package Description: TBD; PCB Footprint: TBD; Rating: TBD; Thickness (mm): 0.50; Value: SN74LVC1G123YZPR; Width (mm): 0.89 ±0.03
U307 = SN74LVC2G08DCU: AND gate, Dual 2-input, BGA-8; Manufacturer: Texas Instruments; Medical Grade MFR: TBD; Category: IC; Length (mm): 1.89 ±0.03; Manufacturer PN: SN74LVC2G08YZPR; Medical Grade MFR PN: TBD; Package Description: TBD; PCB Footprint: TBD; Rating: TBD; Thickness (mm): 0.50; Value: SN74LVC2G08YZPR; Width (mm): 0.89 ±0.03
U308 U309 = MAX4781ETE+T: Multiplexer, 8:1, 0.7 ohms, QFN-16; Manufacturer: Maxim; Medical Grade MFR: TBD; Category: IC; Length (mm): 3.00 ±0.10; Manufacturer PN: MAX4781ETE+T; Medical Grade MFR PN: TBD; Package Description: TBD; PCB Footprint: TBD; Rating: TBD; Thickness (mm): 0.75 ±0.05; Value: MAX4781ETE+T; Width (mm): 3.00 ±0.10
U310 = TLV9002SIYCKR_b: Op Amp, Dual, Rail-to-Rail, 1MHz, BGA-9; Manufacturer: Texas Instruments; Medical Grade MFR: TBD; Rating: 5.5V; Category: IC; Length (mm): 0.95 ±0.03; Manufacturer PN: TLV9002SIYCKR; Medical Grade MFR PN: TBD; PCB Footprint: TBD; Thickness (mm): 0.33; Value: TLV9002SIYCKR; Width (mm): 0.95 ±0.03; Package Description: TBD
U311 = AD8137: Differential Amplifier, 110 MHz, DFN-8; Manufacturer: Analog Devices; Medical Grade MFR: TBD; Category: IC; Length (mm): 3.00 ±0.10; Manufacturer PN: AD8137YCPZ; Medical Grade MFR PN: TBD; Package Description: TBD; PCB Footprint: TBD; Rating: TBD; Thickness (mm): 0.75 ±0.05; Value: AD8137YCPZ; Width (mm): 3.00 ±0.10
U502 = TLV3691IDCK: Comparator, Push-pull output, SC-70; Manufacturer: Texas Instruments; Manufacturer PN: TLV3691IDCKT; Medical Grade MFR: TBD; Value: TLV3691IDCKT; Category: IC; Length (mm): 2.00 ±0.15; Medical Grade MFR PN: TBD; PCB Footprint: TBD; Thickness (mm): 0.95 ±0.15; Width (mm): 1.25 ±0.05; Package Description: TBD; Rating: TBD
U503 = LTC3130IUDC-1: Buck-Boost Converter, Selectable Voltage, QFN-20; Manufacturer: Analog Devices; Manufacturer PN: LTC3130IUDC-1#PBF; Medical Grade MFR: TBD; Rating: 25V; Value: LTC3130IUDC-1#PBF; Category: IC; Length (mm): 4.00 ±0.10; Medical Grade MFR PN: TBD; PackageDescription: TBD; PCB Footprint: TBD; Thickness (mm): 0.75 ±0.05; Width (mm): 3.00 ±0.10
X1-X6 = FIDUCIAL: FIDUCIAL_MARK; Manufacturer PN: FIDUCIAL
X7-X9 = HOLE_UNPLATED
Y1 Y91 = Crystal: Crystal, 32.768kHz, 6.0pF, 70k, CC8V, Implant-grade; Manufacturer: TBD; Medical Grade MFR: Micro Crystal; Medical Grade MFR PN: CC8V-T1A32.768kHz6.0pF±20ppmTAQM; Category: Crystal; Length (mm): 2.00; Manufacturer PN: TBD; PCB Footprint: TBD; Rating: N/A; Thickness (mm): 0.67; Width (mm): 1.20
  Y1: Package Description: TBD
  Y91: Package Description: CC8V
Y2 Y92 = Crystal: Crystal, 48.0MHz, 9.0pF, 20 ohms, CC8A, Implant-grade; Manufacturer: TBD; Medical Grade MFR: Micro Crystal; Medical Grade MFR PN: CC8A-T1A48.000MHz9.0pF±50ppmTAQM; Category: Crystal; Length (mm): 2.00; Manufacturer PN: TBD; PCB Footprint: TBD; Rating: N/A; Thickness (mm): 0.67; Width (mm): 1.20
  Y2: Package Description: TBD
  Y92: Package Description: CC8V